# Altium schematic sheet Sheet1.SchDoc
size A4; SheetNumber: 1; SheetTotal: 8
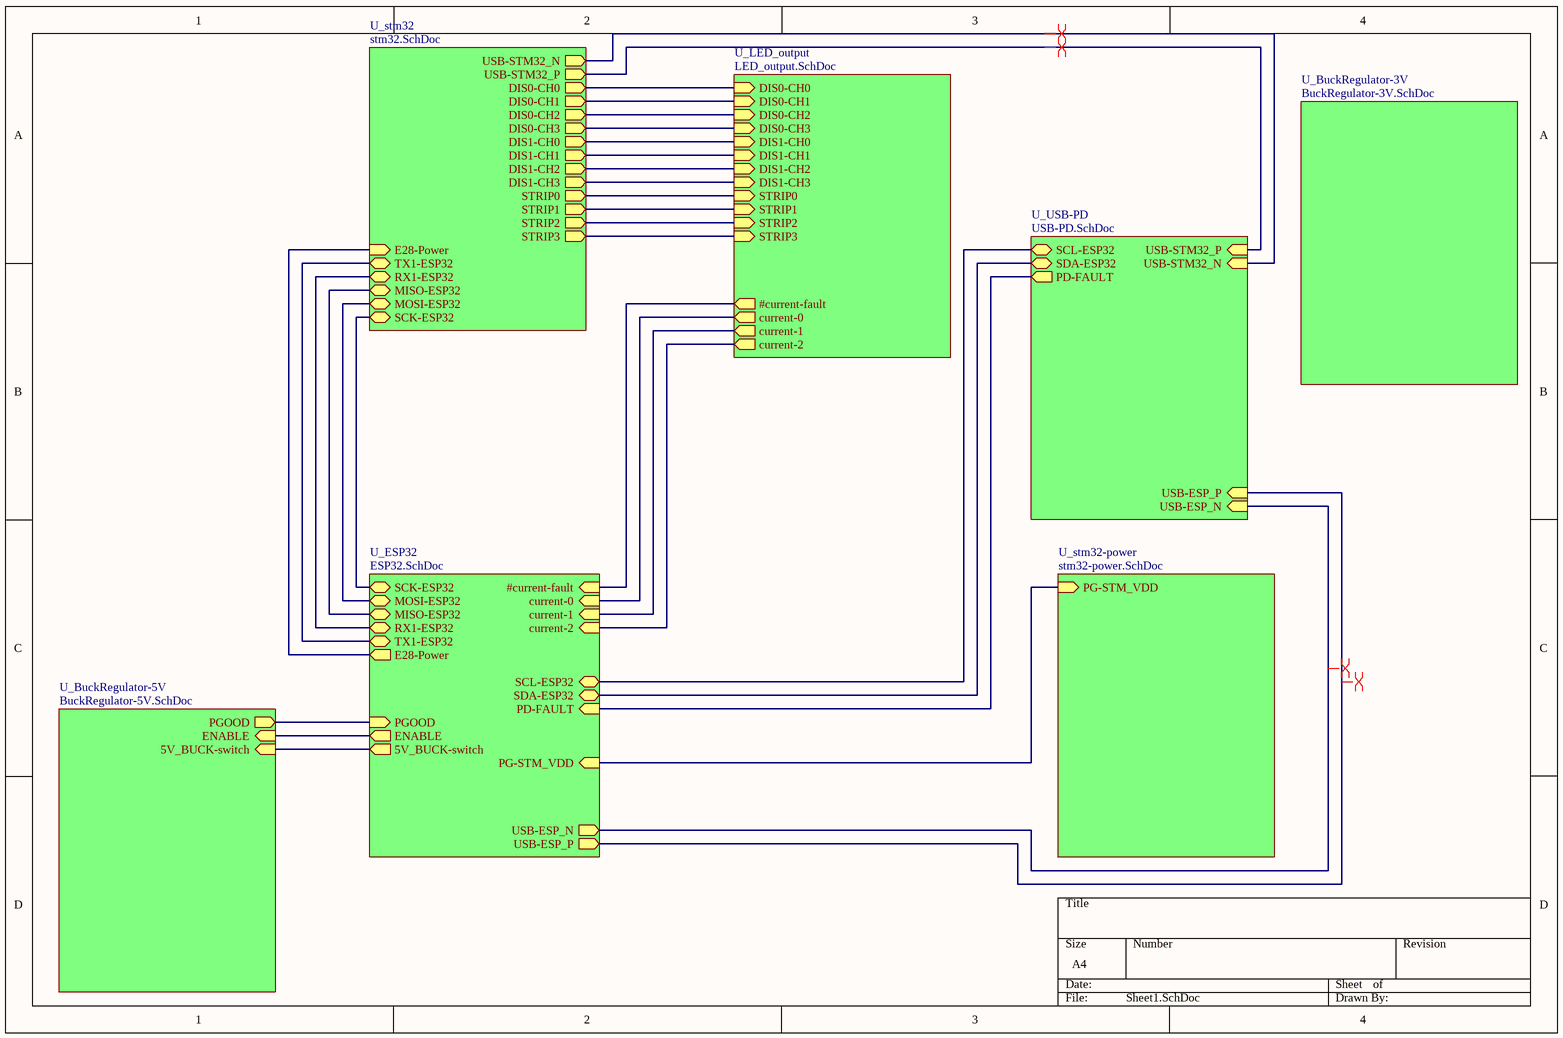
[diagram p0: Sheet1.SchDoc]

## Sub-sheets
U_BuckRegulator-3V = BuckRegulator-3V.SchDoc: no entries
U_BuckRegulator-5V = BuckRegulator-5V.SchDoc: PGOOD (out), ENABLE (in), 5V_BUCK-switch (in)
U_ESP32 = ESP32.SchDoc: USB-ESP_N (out), USB-ESP_P (out), SDA-ESP32 (bidir), SCL-ESP32 (bidir), PD-FAULT (in), current-0 (in), current-1 (in), current-2 (in), #current-fault (in), PGOOD (in), ENABLE (out), SCK-ESP32 (bidir), MOSI-ESP32 (bidir), MISO-ESP32 (bidir), TX1-ESP32 (bidir), RX1-ESP32 (bidir), E28-Power (out), 5V_BUCK-switch (out), PG-STM_VDD (in)
U_LED_output = LED_output.SchDoc: #current-fault (out), current-1 (out), current-0 (out), current-2 (out), DIS0-CH2 (in), DIS0-CH3 (in), DIS0-CH0 (in), DIS0-CH1 (in), DIS1-CH0 (in), DIS1-CH1 (in), DIS1-CH2 (in), DIS1-CH3 (in), STRIP0 (in), STRIP1 (in), STRIP2 (in), STRIP3 (in)
U_stm32 = stm32.SchDoc: DIS0-CH0 (out), DIS0-CH1 (out), DIS0-CH2 (out), DIS0-CH3 (out), DIS1-CH0 (out), DIS1-CH1 (out), DIS1-CH2 (out), DIS1-CH3 (out), STRIP0 (out), STRIP1 (out), STRIP2 (out), STRIP3 (out), SCK-ESP32 (bidir), MOSI-ESP32 (bidir), MISO-ESP32 (bidir), RX1-ESP32 (bidir), TX1-ESP32 (bidir), E28-Power (in), USB-STM32_P (out), USB-STM32_N (out)
U_stm32-power = stm32-power.SchDoc: PG-STM_VDD (in)
U_USB-PD = USB-PD.SchDoc: SCL-ESP32 (bidir), SDA-ESP32 (bidir), PD-FAULT (out), USB-ESP_N (in), USB-ESP_P (in), USB-STM32_N (in), USB-STM32_P (in)

## Nets
(unnamed): sheet U_LED_output/#current-fault, sheet U_ESP32/#current-fault
(unnamed): sheet U_LED_output/current-1, sheet U_ESP32/current-1
(unnamed): sheet U_LED_output/current-0, sheet U_ESP32/current-0
(unnamed): sheet U_LED_output/current-2, sheet U_ESP32/current-2
(unnamed): sheet U_LED_output/DIS0-CH2, sheet U_stm32/DIS0-CH2
(unnamed): sheet U_LED_output/DIS0-CH3, sheet U_stm32/DIS0-CH3
(unnamed): sheet U_LED_output/DIS0-CH0, sheet U_stm32/DIS0-CH0
(unnamed): sheet U_LED_output/DIS0-CH1, sheet U_stm32/DIS0-CH1
(unnamed): sheet U_LED_output/DIS1-CH0, sheet U_stm32/DIS1-CH0
(unnamed): sheet U_LED_output/DIS1-CH1, sheet U_stm32/DIS1-CH1
(unnamed): sheet U_LED_output/DIS1-CH2, sheet U_stm32/DIS1-CH2
(unnamed): sheet U_LED_output/DIS1-CH3, sheet U_stm32/DIS1-CH3
(unnamed): sheet U_LED_output/STRIP0, sheet U_stm32/STRIP0
(unnamed): sheet U_LED_output/STRIP1, sheet U_stm32/STRIP1
(unnamed): sheet U_LED_output/STRIP2, sheet U_stm32/STRIP2
(unnamed): sheet U_LED_output/STRIP3, sheet U_stm32/STRIP3
(unnamed): sheet U_ESP32/USB-ESP_N, sheet U_USB-PD/USB-ESP_N
(unnamed): sheet U_ESP32/USB-ESP_P, sheet U_USB-PD/USB-ESP_P
(unnamed): sheet U_ESP32/SDA-ESP32, sheet U_USB-PD/SDA-ESP32
(unnamed): sheet U_ESP32/SCL-ESP32, sheet U_USB-PD/SCL-ESP32
(unnamed): sheet U_ESP32/PD-FAULT, sheet U_USB-PD/PD-FAULT
(unnamed): sheet U_ESP32/PGOOD, sheet U_BuckRegulator-5V/PGOOD
(unnamed): sheet U_ESP32/ENABLE, sheet U_BuckRegulator-5V/ENABLE
(unnamed): sheet U_ESP32/SCK-ESP32, sheet U_stm32/SCK-ESP32
(unnamed): sheet U_ESP32/MOSI-ESP32, sheet U_stm32/MOSI-ESP32
(unnamed): sheet U_ESP32/MISO-ESP32, sheet U_stm32/MISO-ESP32
(unnamed): sheet U_ESP32/TX1-ESP32, sheet U_stm32/TX1-ESP32
(unnamed): sheet U_ESP32/RX1-ESP32, sheet U_stm32/RX1-ESP32
(unnamed): sheet U_ESP32/E28-Power, sheet U_stm32/E28-Power
(unnamed): sheet U_ESP32/5V_BUCK-switch, sheet U_BuckRegulator-5V/5V_BUCK-switch
(unnamed): sheet U_ESP32/PG-STM_VDD, sheet U_stm32-power/PG-STM_VDD
(unnamed): sheet U_stm32/USB-STM32_P, sheet U_USB-PD/USB-STM32_P
(unnamed): sheet U_stm32/USB-STM32_N, sheet U_USB-PD/USB-STM32_N

## Layout directives
differential pair: (no net found under the mark)